# Altium schematic sheet Place_3D_Body.SchDoc
size A4
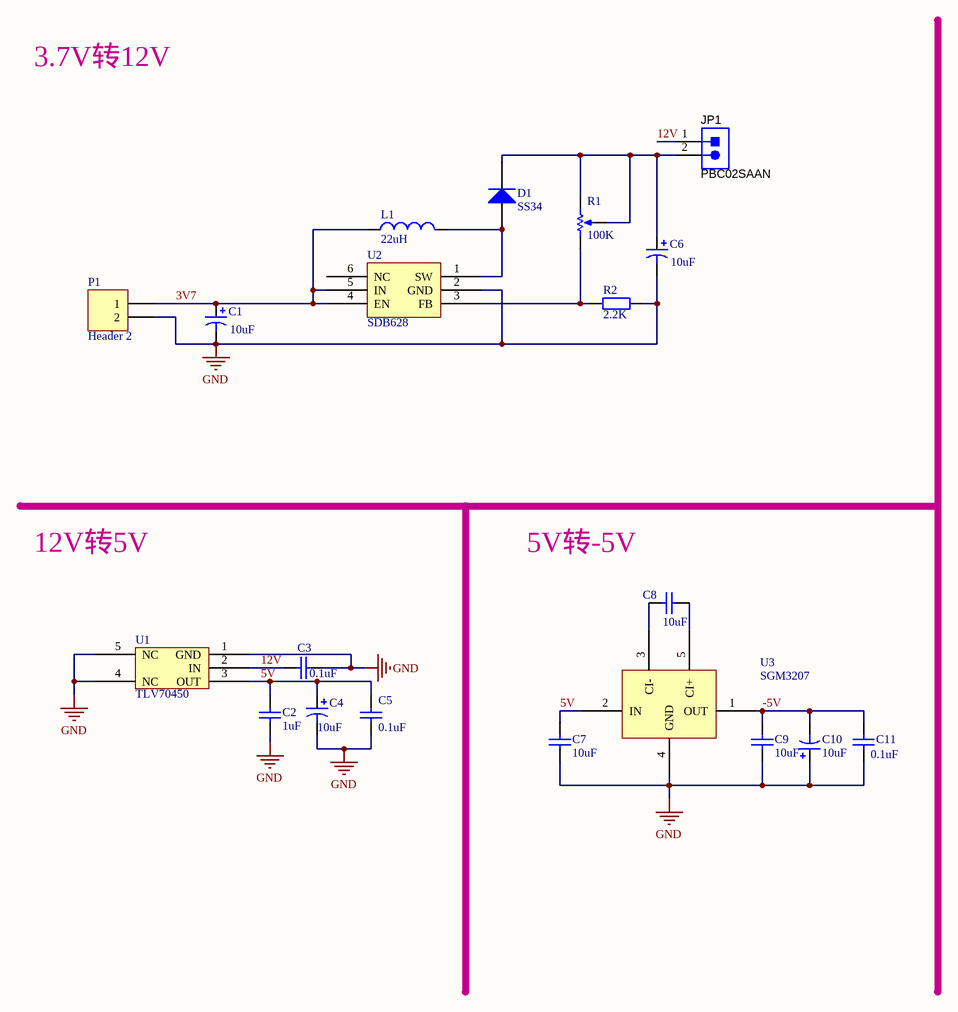
[diagram p0: Place_3D_Body.SchDoc]

## Parts
C1  value 10uF  [tan-a]  (hidden comment: Cap Pol1)
C2  value 1uF  [C-0603]  (hidden comment: Cap)
C3  value 0.1uF  [C-0603]  (hidden comment: Cap)
C4  value 10uF  [tan-a]  (hidden comment: Cap Pol1)
C5  value 0.1uF  [C-0603]  (hidden comment: Cap)
C6  value 10uF  [tan-a]  (hidden comment: Cap Pol1)
C7  value 10uF  [C-0603]  (hidden comment: Cap)
C8  value 10uF  [C-0603]  (hidden comment: Cap)
C9  value 10uF  [C-0603]  (hidden comment: Cap)
C10  value 10uF  [TAN-A]  (hidden comment: Cap Pol1)
C11  value 0.1uF  [C-0603]  (hidden comment: Cap)
D1  SS34  [LC-SMA(DO-214AC)_S2]
JP1  PBC02SAAN  [Sullins_PBC02SAAN]
L1  value 22uH  [SMDRH105R]  (hidden comment: SMDRH105R-220MT)
P1  Header 2  [POWER-p2]
R1  value 100K  [rp-3296-w]  (hidden comment: RPot)
R2  value 2.2K  [r-0603]  (hidden comment: Res2)
U1  TLV70450  [SOT-23-5]
U2  SDB628  [sot-23-6]
U3  SGM3207  [SOT-23-5]

## Nets
GND: C1.2 C2.1 C3.1 C4.2 C5.2 C6.2 C7.1 C9.1 C10.1 C11.2 P1.2 R2.2 U1.1(GND) U1.4(NC) U1.5(NC) U2.2(GND) U3.4(GND)
3V7: C1.1 L1.2 P1.1 U2.4(EN) U2.5(IN)
5V: C2.2 C4.1 C5.1 C7.2 U1.3(OUT) U3.2(IN)
12V: C3.2 JP1.1 U1.2(IN)
-5V: C9.2 C10.2 C11.1 U3.1(OUT)
NetC6_1: C6.1 D1.2(K) JP1.2 R1.2(BOT) R1.3(TAP)
NetC8_1: C8.1 U3.3(CI-)
NetC8_2: C8.2 U3.5(CI+)
NetD1_1: D1.1(A) L1.1 U2.1(SW)
NetR1_1: R1.1(TOP) R2.1 U2.3(FB)

Not connected (* = marked no-connect by the designer): U2 6(NC)

## Notes on the sheet
- 3.7V转12V
- 12V转5V
- 5V转-5V

## Library data of the parts
C1 C4 C6 C10 = Cap Pol1: Polarized Capacitor (Radial); Published: 8-Jun-2000; LatestRevisionDate: 17-Jul-2002; LatestRevisionNote: Re-released for DXP Platform.; PackageReference: RB7.6-15; Publisher: Altium Limited; PackageDescription: Polarized Capacitor (Radial); 2 Leads
C2 C3 C5 C7-C9 C11 = Cap: Capacitor; Published: 8-Jun-2000; LatestRevisionDate: 17-Jul-2002; LatestRevisionNote: Re-released for DXP Platform.; PackageReference: RAD-0.3; Publisher: Altium Limited
D1 = Diode: Default Diode; Published: 8-Jun-2000; LatestRevisionDate: 17-Jul-2002; LatestRevisionNote: Re-released for DXP Platform.; PackageVersion: Sep-1996; PackageReference: SMC; Publisher: Altium Limited; Code_JEDEC: DO-214-AB
JP1 = PBC02SAAN: Header, 100mil, 2x1, Gold, TH; Manufacturer: Sullins Connector Solutions; SymbolCreator: a0412235; Pitch_mm: 2.54; Gender: Male; Shrouded: N; Row_Count: 1; Current_A: 3; Voltage_V: 1800; Cert_UL: Y; SymbolVersion: 2013-10-31; PartNumber: PBC02SAAN; PackageReference: Sullins 100mil, 1x2, 230 mil above insulator; ClassName: Header; CompType: Header; RoHS: Y; MountType: TH; ComponentLink1Description: Datasheet URL; ComponentLink1URL: http://www.sullinscorp.com/catalogs/77_PAGE108-109_.100_MALE_HDR.pdf; Orientation: Vertical; PinCount: 2; ContactFinish: Gold; Color: Black; Publisher: Texas Instruments; LatestRevisionDate: 2016-03-04; Supplier 1: Digi-Key; Supplier Part Number 1: S1011E-02-ND
L1 = Inductor: Code_IEC: 1005; Published: 8-Jun-2000; LatestRevisionDate: 29-May-2009; LatestRevisionNote: IPC-7351 Footprint Added.; PackageReference: 0402-A; Publisher: Altium Limited; PackageDescription: Chip Inductor; Code_JEITA: 0402
P1 = Header 2: Header, 2-Pin; LatestRevisionDate: 17-Jul-2002; LatestRevisionNote: Re-released for DXP Platform.; Publisher: Altium Limited
R1 = RPot: Potentiometer; Sim Note: Enter the Resistance value and the set point into parameter fields.; Set Position: 0.5; Published: 8-Jun-2000; LatestRevisionDate: 17-Jul-2002; LatestRevisionNote: Re-released for DXP Platform.; PackageReference: VR5; Publisher: Altium Limited; PackageDescription: Variable Resistor, Thru-Hole; 3 Leads
R2 = Res2: Resistor; Published: 8-Jun-2000; LatestRevisionDate: 17-Jul-2002; LatestRevisionNote: Re-released for DXP Platform.; PackageReference: AXIAL-0.4; Publisher: Altium Limited
U1 = TLV704
U3 = TPS6040x